# EAGLE design AnalogPair (EAGLE 8.5.2)
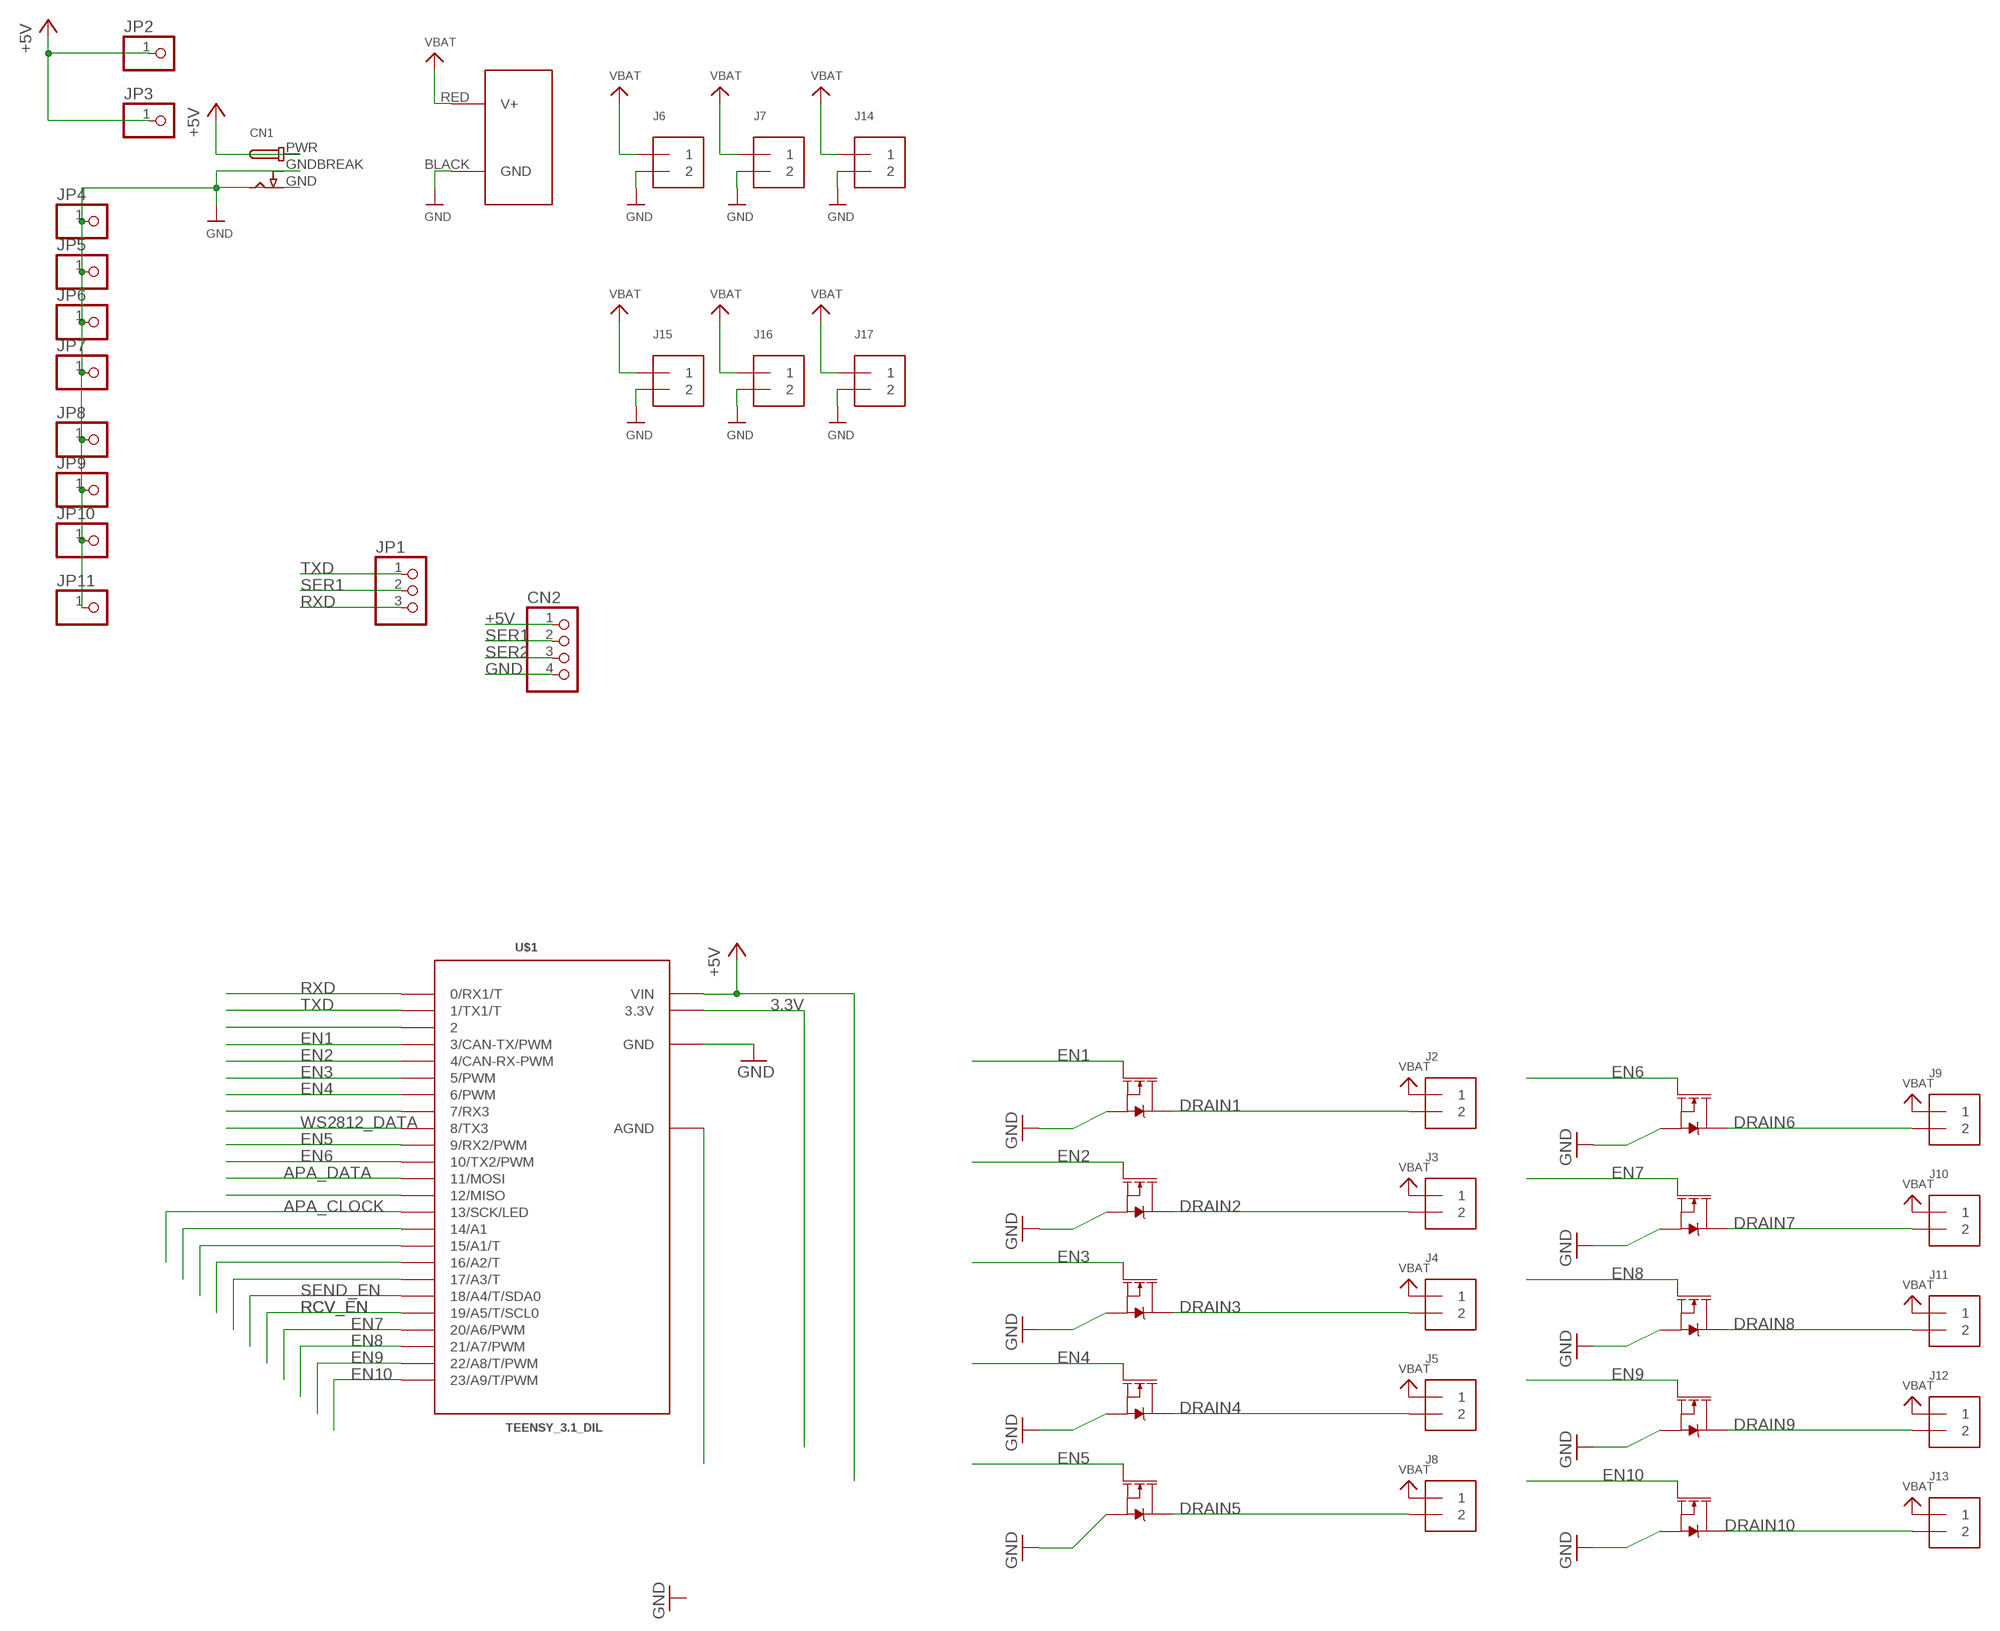
[diagram p0: schematic, sheet 1]

## Parts
CN1  DCBARRELPTH  [DCJACK_2MM_PTH]
CN2  HEADER-1X4  [1X04_OVAL]
J1  POWERPOLE_POWER25A  [POWERPOLE_PAIR_25A]
J2  TERMBLOCK_1X2  [TERMBLOCK_1X2-3.5MM]
J3  TERMBLOCK_1X2  [TERMBLOCK_1X2-3.5MM]
J4  TERMBLOCK_1X2  [TERMBLOCK_1X2-3.5MM]
J5  TERMBLOCK_1X2  [TERMBLOCK_1X2-3.5MM]
J6  TERMBLOCK_1X2  [TERMBLOCK_1X2-3.5MM]
J7  TERMBLOCK_1X2  [TERMBLOCK_1X2-3.5MM]
J8  TERMBLOCK_1X2  [TERMBLOCK_1X2-3.5MM]
J9  TERMBLOCK_1X2  [TERMBLOCK_1X2-3.5MM]
J10  TERMBLOCK_1X2  [TERMBLOCK_1X2-3.5MM]
J11  TERMBLOCK_1X2  [TERMBLOCK_1X2-3.5MM]
J12  TERMBLOCK_1X2  [TERMBLOCK_1X2-3.5MM]
J13  TERMBLOCK_1X2  [TERMBLOCK_1X2-3.5MM]
J14  TERMBLOCK_1X2  [TERMBLOCK_1X2-3.5MM]
J15  TERMBLOCK_1X2  [TERMBLOCK_1X2-3.5MM]
J16  TERMBLOCK_1X2  [TERMBLOCK_1X2-3.5MM]
J17  TERMBLOCK_1X2  [TERMBLOCK_1X2-3.5MM]
JP1  PINHD-1X3  [1X03]
JP2  PINHD-1X1  [1X01]
JP3  PINHD-1X1  [1X01]
JP4  PINHD-1X1  [1X01]
JP5  PINHD-1X1  [1X01]
JP6  PINHD-1X1  [1X01]
JP7  PINHD-1X1  [1X01]
JP8  PINHD-1X1  [1X01]
JP9  PINHD-1X1  [1X01]
JP10  PINHD-1X1  [1X01]
JP11  PINHD-1X1  [1X01]
Q1  35A/25V/8.5mΩ  MOSFET-NCH-FDD8780  [DPAK]
Q2  35A/25V/8.5mΩ  MOSFET-NCH-FDD8780  [DPAK]
Q3  35A/25V/8.5mΩ  MOSFET-NCH-FDD8780  [DPAK]
Q4  35A/25V/8.5mΩ  MOSFET-NCH-FDD8780  [DPAK]
Q5  35A/25V/8.5mΩ  MOSFET-NCH-FDD8780  [DPAK]
Q6  35A/25V/8.5mΩ  MOSFET-NCH-FDD8780  [DPAK]
Q7  35A/25V/8.5mΩ  MOSFET-NCH-FDD8780  [DPAK]
Q8  35A/25V/8.5mΩ  MOSFET-NCH-FDD8780  [DPAK]
Q9  35A/25V/8.5mΩ  MOSFET-NCH-FDD8780  [DPAK]
Q10  35A/25V/8.5mΩ  MOSFET-NCH-FDD8780  [DPAK]
U$1  TEENSY_3.1_DIL  [TEENSY3-DIL]

## Nets
3.3V: U$1.3.3V
+5V: CN1.PWR CN2.1 JP2.1 JP3.1 U$1.VIN
APA_CLOCK: U$1.13(13/SCK/LED)
APA_DATA: U$1.11(11/MOSI)
DRAIN1: J2.2 Q1.4(D)
DRAIN2: J3.2 Q3.4(D)
DRAIN3: J4.2 Q5.4(D)
DRAIN4: J5.2 Q6.4(D)
DRAIN5: J8.2 Q2.4(D)
DRAIN6: J9.2 Q4.4(D)
DRAIN7: J10.2 Q7.4(D)
DRAIN8: J11.2 Q8.4(D)
DRAIN9: J12.2 Q9.4(D)
DRAIN10: J13.2 Q10.4(D)
EN1: Q1.1(G) U$1.3(3/CAN-TX/PWM)
EN2: Q3.1(G) U$1.4(4/CAN-RX-PWM)
EN3: Q5.1(G) U$1.5(5/PWM)
EN4: Q6.1(G) U$1.6(6/PWM)
EN5: Q2.1(G) U$1.9(9/RX2/PWM)
EN6: Q4.1(G) U$1.10(10/TX2/PWM)
EN7: Q7.1(G) U$1.20/A6(20/A6/PWM)
EN8: Q8.1(G) U$1.21/A7(21/A7/PWM)
EN9: Q9.1(G) U$1.22/A8(22/A8/T/PWM)
EN10: Q10.1(G) U$1.23/A9(23/A9/T/PWM)
GND: CN1.GND CN1.GNDBREAK CN2.4 J1.BLACK(GND) J6.2 J7.2 J14.2 J15.2 J16.2 J17.2 JP4.1 JP5.1 JP6.1 JP7.1 JP8.1 JP9.1 JP10.1 JP11.1 Q1.3(S) Q2.3(S) Q3.3(S) Q4.3(S) Q5.3(S) Q6.3(S) Q7.3(S) Q8.3(S) Q9.3(S) Q10.3(S) U$1.GND
N$6: U$1.2
N$7: U$1.7(7/RX3)
N$10: U$1.12(12/MISO)
N$12: U$1.14/A0(14/A1)
N$13: U$1.15/A1(15/A1/T)
N$14: U$1.16/A2(16/A2/T)
N$15: U$1.17/A3(17/A3/T)
N$18: U$1.AGND
RCV_EN: U$1.19/A5(19/A5/T/SCL0)
RXD: JP1.3 U$1.0(0/RX1/T)
SEND_EN: U$1.18/A4(18/A4/T/SDA0)
SER1: CN2.2 JP1.2
SER2: CN2.3
TXD: JP1.1 U$1.1(1/TX1/T)
VBAT: J1.RED(V+) J2.1 J3.1 J4.1 J5.1 J6.1 J7.1 J8.1 J9.1 J10.1 J11.1 J12.1 J13.1 J14.1 J15.1 J16.1 J17.1
WS2812_DATA: U$1.8(8/TX3)

## Library data of the parts
CN1 = microbuilder:DCBARREL: DC Barrel Jack DCJACK_1.3MM_PTH - Through Hole 1.3mm Jack (4UConnector: 05536) DCJACK_2MM_PTH - Through Hole 2.0/2.1 Jack (4UConnector: 05537) DCJACK_2MM_SMT - SMT 2.0/2.1mm Jack(4UConnector: 03267)
CN2 = microbuilder:HEADER-1X4: PIN HEADER
J1 = powerpoles:POWERPOLE_POWER: Anderson Powerpole Power Connector using ameteur radio standard layout
J2-J17 = microbuilder:TERMBLOCK_1X2: 3.5mm Terminal block http://www.ladyada.net/library/pcb/eaglelibrary.html
JP1 = adafruit:PINHD-1X3: PIN HEADER
JP2-JP11 = adafruit:PINHD-1X1: Pin header 1x1 for 0.1" spacing With round pins
Q1-Q10 = SparkFun-DiscreteSemi:MOSFET-NCH: N-channel MOSFETs Voltage controlled devices that allow control of high current outputs. SparkFun Products: SparkFun OpenScale <https://www.sparkfun.com/products/13261> SparkFun Digital Sandbox <https://www.sparkfun.com/products/12651> SparkFun Monster Moto Shield <https://www.sparkfun.com/products/10182> SparkFun MOSFET Power Controller <https://www.sparkfun.com/products/11214>; PROD_ID: TRANS-09984
U$1 = Teensy_3_and_LC_Series_Boards_v1.0:TEENSY_3.1_DIL: Teensy 3.1 or 3.2 in a DIL Layout.

## Board
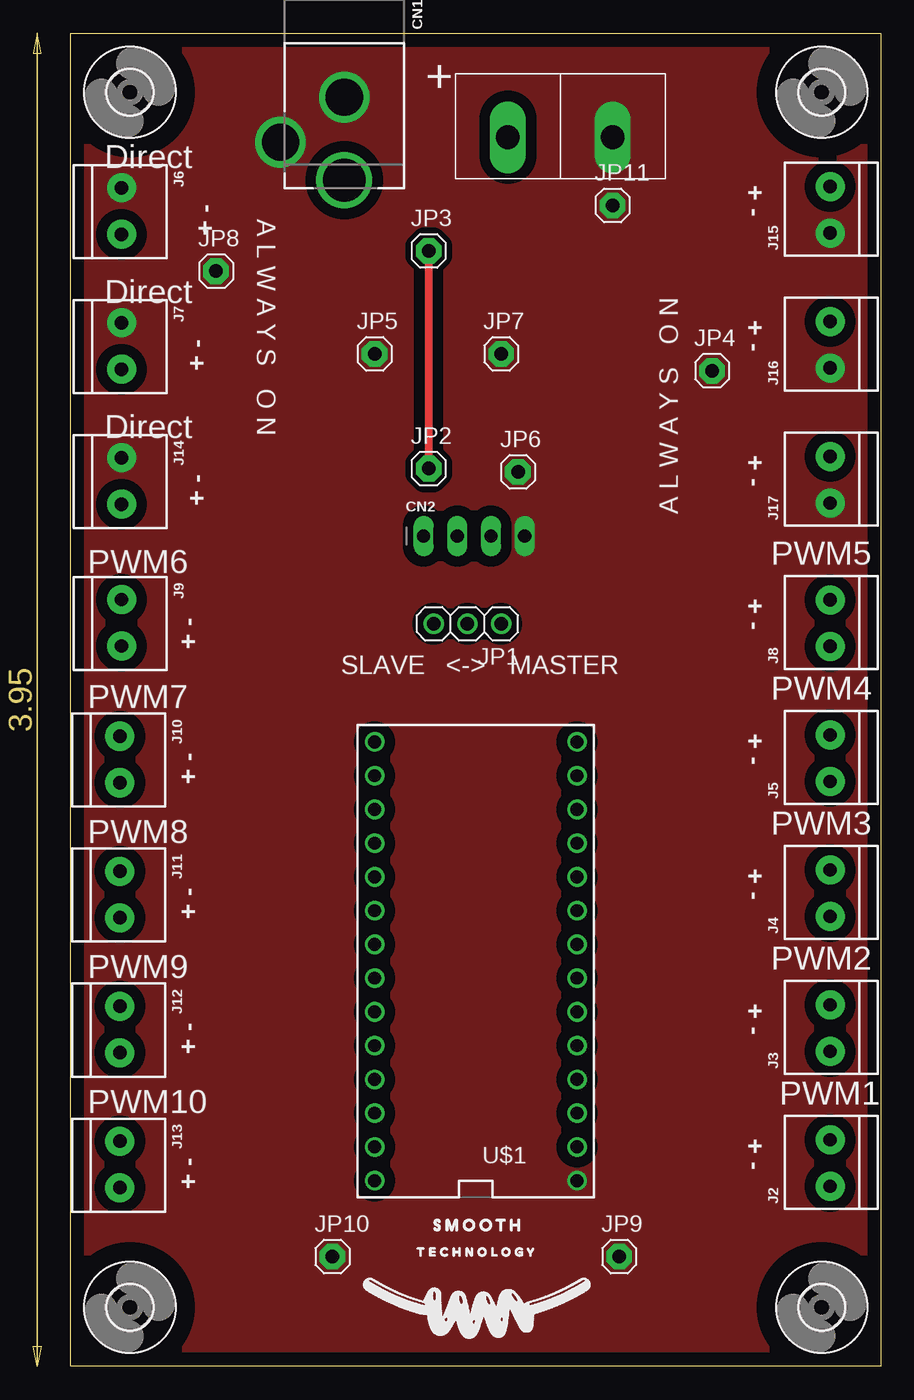
[diagram p1: board, top side]
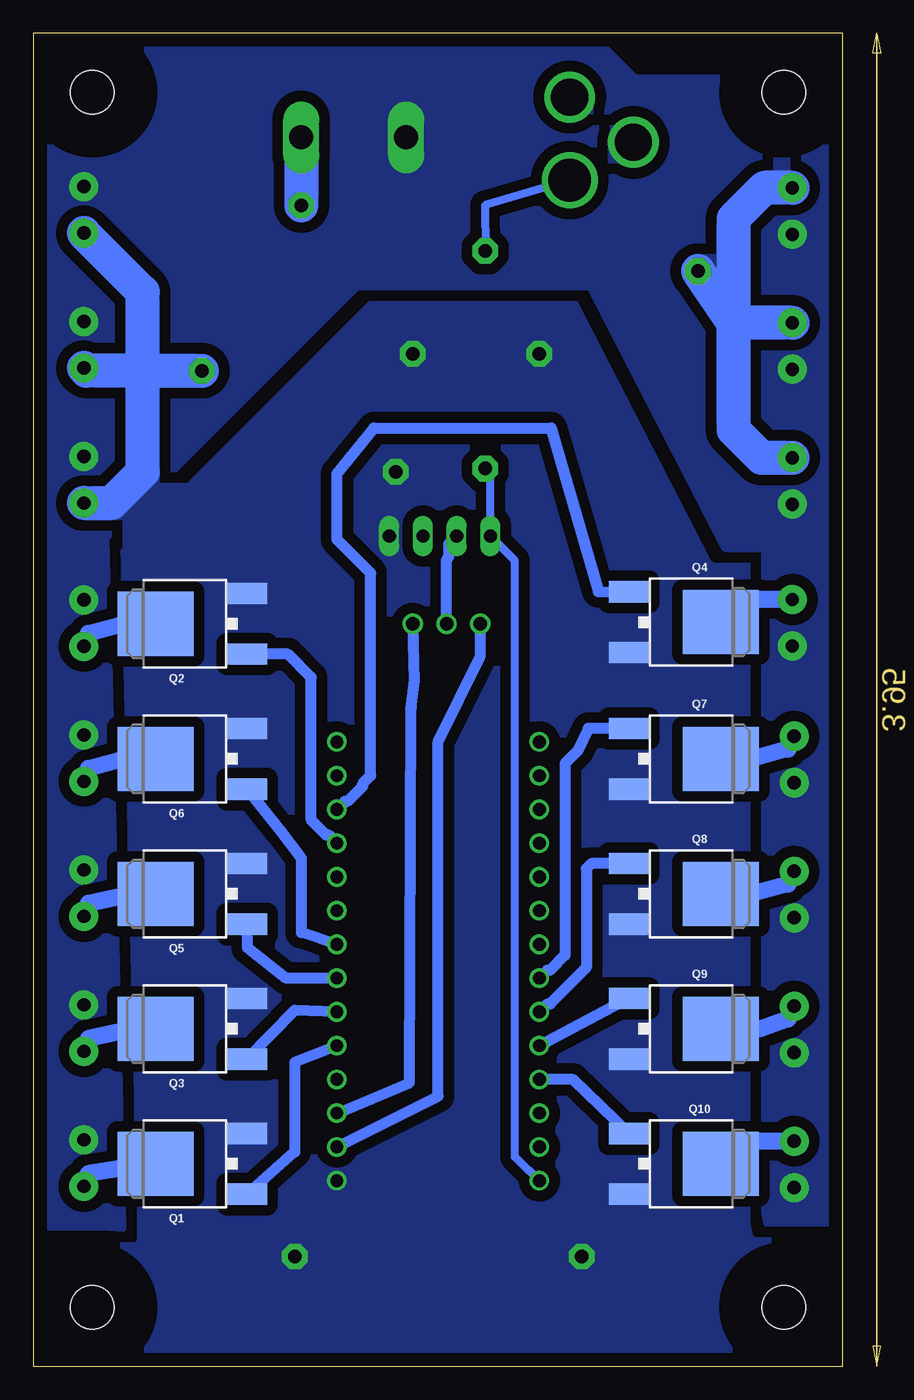
[diagram p2: board, bottom side, seen from below]

Size 60.96 x 100.33 mm. Coordinates in mm from the lower left corner, seen from the top.
Outline: 60.96,100.33 60.96,0 0,0 0,100.33 60.96,100.33
Copper layers (1*16): Top 0.035mm / dielectric 1.5mm / Bottom 0.035mm
Design rules "default": minimum track width 6mil, minimum drill 0.35mm, track to track 6mil, track to pad 6mil, pad to pad 6mil, via to via 6mil, smd to smd 6mil, copper to edge 40mil, drill to drill 6mil, minimum pad ring 10mil, minimum via ring 8mil, stop-mask expansion 4mil, vias tented up to drill 0mil, thermal gap 10mil

### Footprints (pad centres in the part's own frame; a part is rotated, then mirrored left to right if it is on the bottom)
DCJACK_2MM_PTH = drill 2.8: GND 0,7.35; GNDBREAK 4.8,10.75 | drill 3.2: PWR 0,13.6
1X04_OVAL = drill 1 long: 1 -3.81,0; 2 -1.27,0; 3 1.27,0; 4 3.81,0
POWERPOLE_PAIR_25A = drill 1.8 long: BLACK 3.95,-0.85; RED -3.95,-0.85
TERMBLOCK_1X2-3.5MM = drill 1 pad 2.184: 1 1.8,0; 2 -1.7,0
1X03 = drill 1.016: 1 -2.54,0; 2 0,0; 3 2.54,0
1X01 = drill 1.016 pad 1.93 octagon: 1 0,0
DPAK = smd 1.6 x 3: 1 -2.28,-5.31; 3 2.28,-5.31 | smd 4.826 x 5.715: 4 0,1.588
TEENSY3-DIL = drill 0.965: 0 -7.62,13.97; 1 -7.62,11.43; 2 -7.62,8.89; 3 -7.62,6.35; 3.3V 7.62,11.43; 4 -7.62,3.81; 5 -7.62,1.27; 6 -7.62,-1.27; 7 -7.62,-3.81; 8 -7.62,-6.35; 9 -7.62,-8.89; 10 -7.62,-11.43; 11 -7.62,-13.97; 12 -7.62,-16.51; 13 7.62,-16.51; 14/A0 7.62,-13.97; 15/A1 7.62,-11.43; 16/A2 7.62,-8.89; 17/A3 7.62,-6.35; 18/A4 7.62,-3.81; 19/A5 7.62,-1.27; 20/A6 7.62,1.27; 21/A7 7.62,3.81; 22/A8 7.62,6.35; 23/A9 7.62,8.89; AGND 7.62,13.97; GND -7.62,16.51; VIN 7.62,16.51
3,3 = hole 3.3: 0,0

### Placement (x,y rotation side)
CN1  20.57,102.87 180 top
CN2  30.35,62.48 0 top
J1  36.83,93.34 0 top
J2  57.15,15.24 90 top
J3  57.15,25.4 90 top
J4  57.15,35.56 90 top
J5  57.15,45.72 90 top
J6  3.81,87 270 top
J7  3.81,76.83 270 top
J8  57.15,55.88 90 top
J9  3.81,56.01 270 top
J10  3.68,45.72 270 top
J11  3.68,35.56 270 top
J12  3.68,25.4 270 top
J13  3.68,15.24 270 top
J14  3.81,66.67 270 top
J15  57.15,87 90 top
J16  57.15,76.83 90 top
J17  57.15,66.67 90 top
JP1  29.84,55.88 180 top
JP2  26.92,67.56 0 top
JP3  26.92,83.95 0 top
JP4  48.26,74.93 0 top
JP5  22.86,76.2 0 top
JP6  33.66,67.31 0 top
JP7  32.38,76.2 0 top
JP8  10.92,82.42 0 top
JP9  41.27,8.26 0 top
JP10  19.68,8.26 0 top
JP11  40.77,87.38 0 top
Q1  50.16,15.24 90 bottom
Q2  50.16,55.88 90 bottom
Q3  50.16,25.4 90 bottom
Q4  10.79,56.01 270 bottom
Q5  50.16,35.56 90 bottom
Q6  50.16,45.72 90 bottom
Q7  10.79,45.72 270 bottom
Q8  10.79,35.56 270 bottom
Q9  10.79,25.4 270 bottom
Q10  10.79,15.24 270 bottom
U$1  30.48,30.48 180 top
U$11  [3,3]  4.45,95.89 0 top
U$13  [SMOOTH_]  27.3,10.16 0 top
U$14  [TECHNOLOGY_]  26.04,8.26 0 top
U$15  [3,3]  56.52,95.89 0 top
U$16  [3,3]  4.45,4.45 0 top
U$17  [SMOOTH_LOGO]  30.48,3.81 0 top
U$19  [3,3]  56.52,4.45 0 top

### Tracks (layer width: path | path; a pad name or v marks a point on that pad's centre or on a via)
+5V
  Top 0.61: JP3.1 JP2.1
  Bottom 0.61: U$1.VIN 23.57,14.68 23.62,14.68 24.7,15.75 24.7,60.64 CN2.1 26.54,67.18 JP2.1 | CN1.PWR 26.93,87.38 JP3.1
DRAIN1
  Bottom 1.27: Q1.4 52.21,15.24 56.74,14.52 56.81,14.52 J2.2
DRAIN2
  Bottom 1.27: Q3.4 53.48,25.4 56.74,24.68 56.81,24.68 J3.2
DRAIN3
  Bottom 1.27: Q5.4 53.48,35.56 56.74,34.84 56.81,34.84 J4.2
DRAIN4
  Bottom 1.27: Q6.4 54.11,45.72 56.74,45 56.81,45 J5.2
DRAIN5
  Bottom 1.27: Q2.4 54.11,55.88 56.74,55.16 56.81,55.16 J8.2
DRAIN6
  Bottom 1.27: J9.2 7.51,57.71 Q4.4
DRAIN7
  Bottom 1.27: J10.2 4.15,46.44 4.22,46.44 6.85,45.72 Q7.4
DRAIN8
  Bottom 1.27: J11.2 4.15,36.28 4.22,36.28 6.85,35.56 Q8.4
DRAIN9
  Bottom 1.27: J12.2 4.15,26.12 4.22,26.12 6.21,25.4 Q9.4
DRAIN10
  Bottom 1.27: J13.2 7.51,16.94 Q10.4
EN1
  Bottom 0.813: U$1.3 41.27,22.86 41.27,16.13 Q1.1
EN2
  Bottom 0.813: U$1.4 41.27,26.8 Q3.1
EN3
  Bottom 0.813: U$1.5 41.91,29.21 44.83,31.5 Q5.1
EN4
  Bottom 0.813: U$1.6 40.77,32.64 40.77,38.23 42.29,40.26 Q6.1
EN5
  Bottom 0.813: U$1.9 38.7,39.97 38.9,39.97 40.04,41.11 40.04,51.85 41.78,53.59 Q2.1
EN6
  Bottom 0.813: U$1.10 37.5,42.51 37.3,42.51 36.16,43.65 36.16,43.85 35.56,44.45 35.56,59.69 38.1,62.23 38.1,67.18 35.31,70.61 21.97,70.61 18.41,58.29 Q4.1
EN7
  Bottom 0.813: Q7.1 19.18,48.01 19.94,46.35 20.92,45.37 20.92,30.95 22.06,29.81 22.26,29.81 U$1.20/A6
EN8
  Bottom 0.813: Q8.1 18.94,37.84 19.32,37.47 19.32,30.01 22.06,27.27 22.26,27.27 U$1.21/A7
EN9
  Bottom 0.813: Q9.1 U$1.22/A8
EN10
  Bottom 0.813: Q10.1 20.32,21.59 U$1.23/A9
GND
  Bottom 1.27: 3.89,78.61 J7.2
  Bottom 2.54: J17.2 55.04,64.98 52.7,67.31 52.7,74.93 | 52.7,74.93 56.95,74.93 J16.2 | 52.7,74.93 52.7,80.85 J15.2 | 52.7,74.93 JP4.1 | J7.2 8.26,78.53 | 8.26,78.53 10.84,82.34 JP8.1 | J6.2 5.92,88.69 8.26,86.36 8.26,78.53 | 8.26,78.53 8.26,70.48 6.14,68.38 J14.2 | JP11.1 40.77,92.48 J1.BLACK
  pour Bottom (isolate 0.813, rank 2, no thermals): -12.7,119.38 82.55,119.38 82.55,-13.97 -12.7,-13.97
  pour Top (isolate 0.813, no thermals): -12.7,119.38 82.55,119.38 82.55,-13.97 -12.7,-13.97
RXD
  Bottom 0.813: U$1.0 30.48,20.32 30.48,46.99 27.3,53.47 JP1.3
SER1
  Bottom 0.813: CN2.2 29.67,61.9 29.67,60.92 29.84,60.74 JP1.2
TXD
  Bottom 0.813: U$1.1 32.64,21.34 32.51,49.53 32.26,51.56 JP1.1
VBAT
  pour Bottom (isolate 0.813, no thermals): -0.64,10.79 5.71,10.79 5.84,11.56 5.84,61.72 5.33,62.23 -0.64,62.23
  pour Bottom (isolate 0.813, no thermals): -0.38,96.9 15.62,96.9 19.05,100.33 28.7,100.33 32.38,100.71 36.83,99.06 36.83,81.28 19.05,81.28 8.89,61.59 -0.64,61.59
  pour Bottom (isolate 0.813, no thermals): 31.75,100.33 60.83,100.33 62.99,100.58 62.99,10.54 55.63,10.54 54.23,10.41 55.5,62.36 31.75,86.11

### Text on the board
tPlace: + - | A L W A Y S O N | + - | + - | + - | + - | + - | A L W A Y S O N | PWM6 | PWM5 | + - | + - | SLAVE | <-> | MASTER | PWM7 | PWM4 | + - | + - | PWM3 | PWM8 | + - | + - | PWM2 | PWM9 | + - | + - | PWM1 | PWM10 | + - | + -
tNames: Direct | Direct | Direct
tSilk: Direct | Direct | Direct